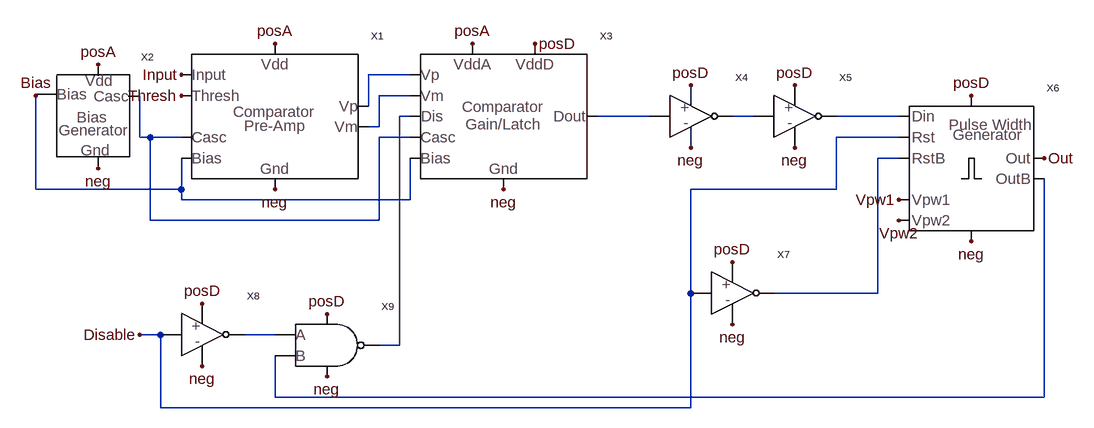
[diagram p0: schematic comparatorLVS.asc]
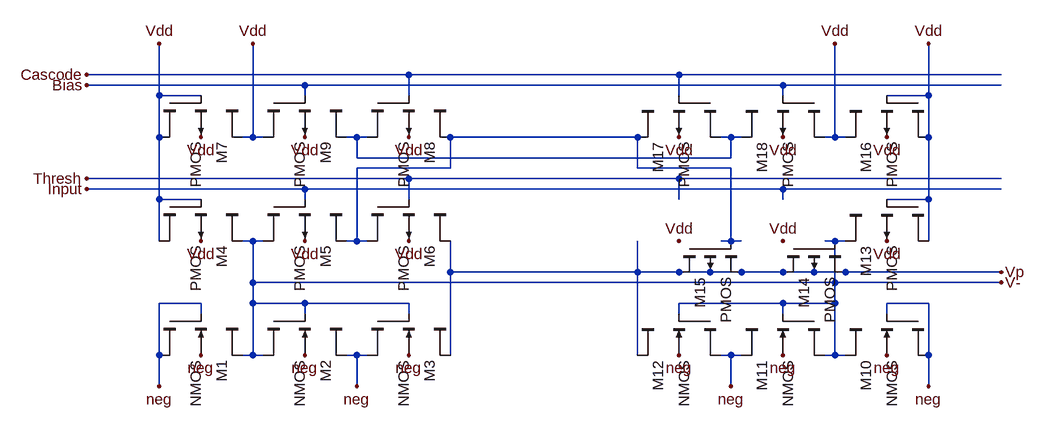
[diagram p1: sub-circuit doublecomparatorpreamplvs.asc]
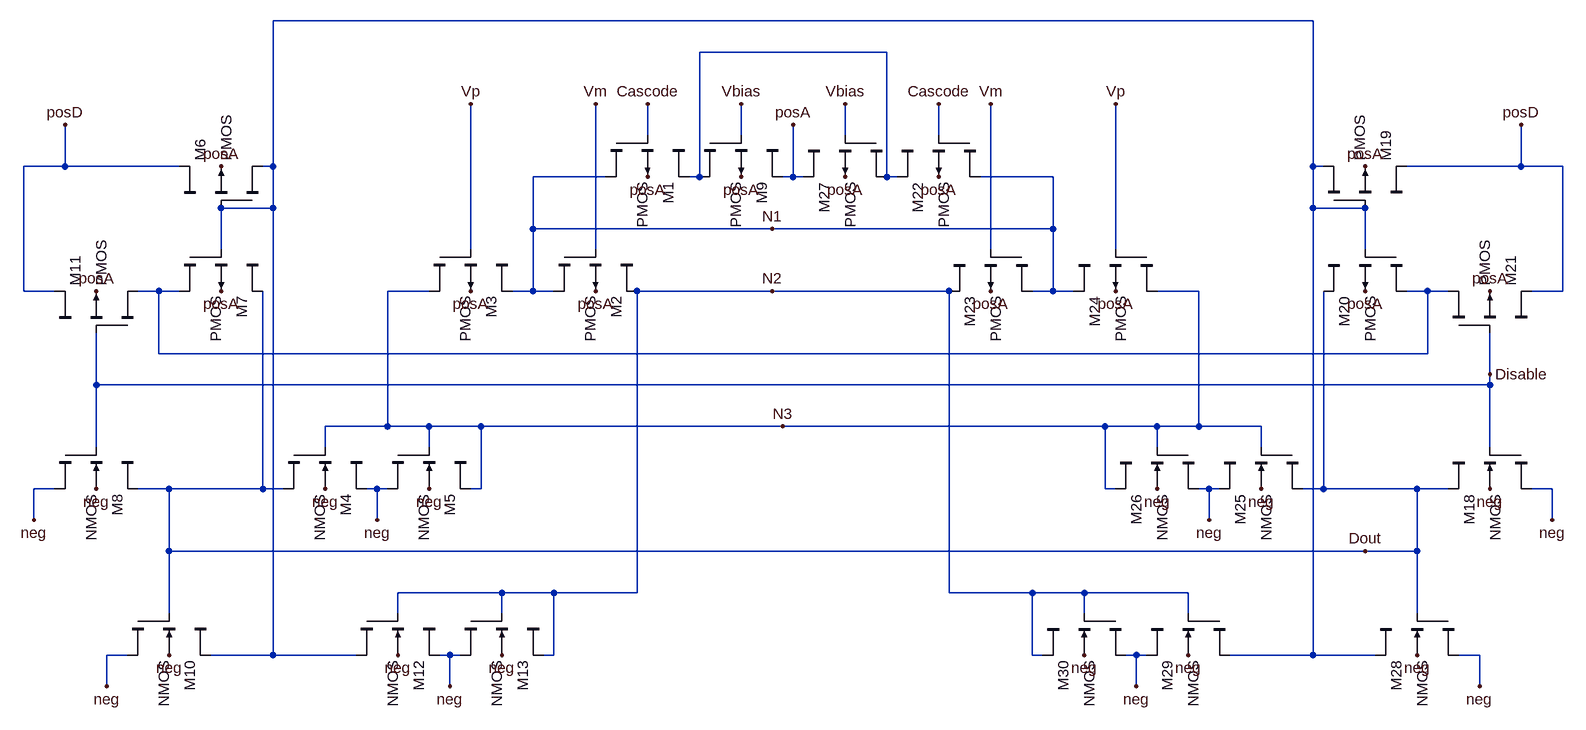
[diagram p2: sub-circuit comparator_gainlatch_lds.asc]
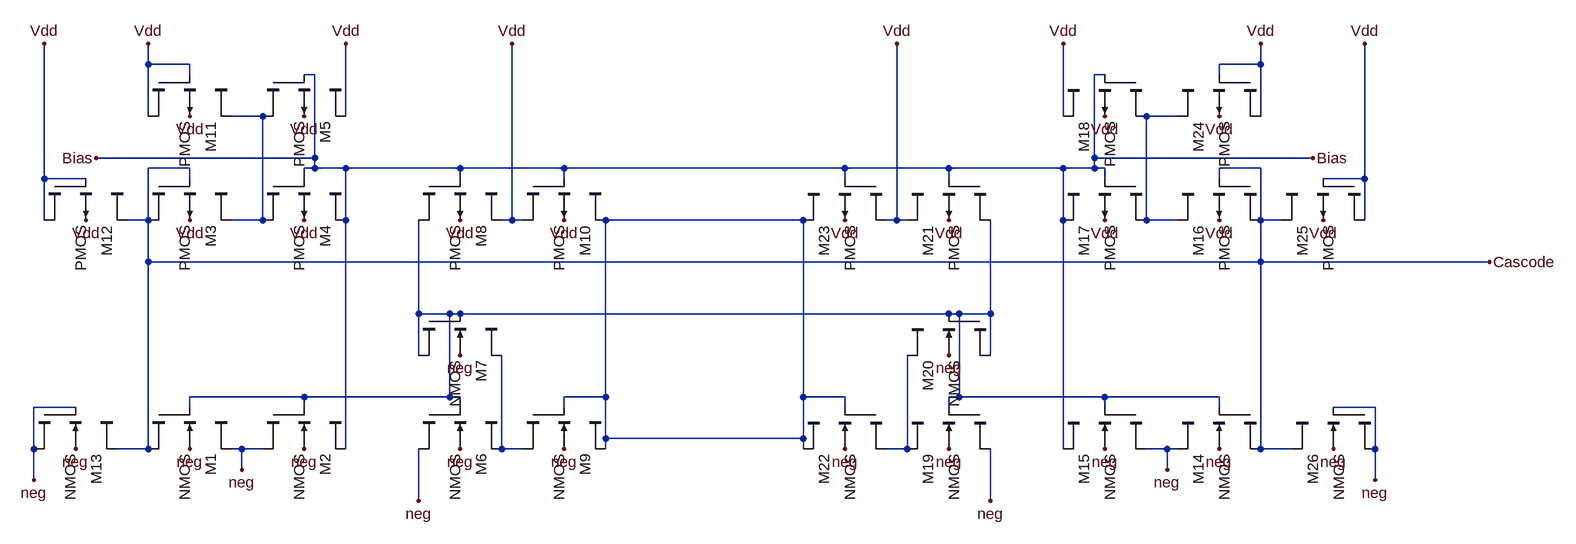
[diagram p3: sub-circuit doublebiaslvs.asc]
comparatorLVS.asc, the LTspice schematic file:
Version 4
SHEET 1 1360 680
WIRE 320 112 256 112
WIRE 320 144 272 144
WIRE 256 160 256 112
WIRE 320 176 304 176
WIRE 688 176 608 176
WIRE 848 176 816 176
WIRE 1072 176 976 176
WIRE 272 192 272 144
WIRE 272 192 256 192
WIRE -96 208 -96 144
WIRE -80 208 -96 208
WIRE -32 208 -80 208
WIRE 320 208 272 208
WIRE 1072 208 976 208
WIRE 1072 240 1040 240
WIRE -256 288 -256 144
WIRE -32 288 -32 240
WIRE -32 288 -256 288
WIRE 976 288 976 208
WIRE 976 288 752 288
WIRE -32 304 -32 288
WIRE 320 304 320 240
WIRE 320 304 -32 304
WIRE -80 336 -80 208
WIRE 272 336 272 208
WIRE 272 336 -80 336
WIRE 752 448 752 288
WIRE 1040 448 1040 240
WIRE 1040 448 880 448
WIRE -64 512 -96 512
WIRE 112 512 64 512
WIRE 304 528 304 176
WIRE 304 528 272 528
WIRE 112 608 112 544
WIRE 1296 608 1296 272
WIRE 1296 608 112 608
WIRE -64 624 -64 512
WIRE 752 624 752 448
WIRE 752 624 -64 624
FLAG -32 112 Input
FLAG -32 144 Thresh
FLAG -256 144 Bias
FLAG -160 96 posA
FLAG 112 64 posA
FLAG 416 64 posA
FLAG 512 64 posD
FLAG 752 128 posD
FLAG -160 256 neg
FLAG 112 288 neg
FLAG 464 288 neg
FLAG 752 224 neg
FLAG 912 128 posD
FLAG 912 224 neg
FLAG 1184 144 posD
FLAG 1184 368 neg
FLAG 816 400 posD
FLAG 816 496 neg
FLAG 0 560 neg
FLAG -96 512 Disable
FLAG 0 464 posD
FLAG 192 480 posD
FLAG 192 576 neg
FLAG 1296 240 Out
FLAG 1072 304 Vpw1
FLAG 1072 336 Vpw2
SYMBOL doubleComparatorPreampLVS 112 176 R0
SYMATTR InstName X1
SYMBOL comparator_gainlatch_LDS 464 176 R0
SYMATTR InstName X3
SYMBOL doublebiasLVS -176 176 R0
SYMATTR InstName X2
SYMBOL Inverter 752 176 R0
SYMATTR InstName X4
SYMBOL Inverter 912 176 R0
SYMATTR InstName X5
SYMBOL PulseWidthControl_LDS 1184 256 R0
SYMATTR InstName X6
SYMBOL Inverter 816 448 R0
SYMATTR InstName X7
SYMBOL Inverter 0 512 R0
SYMATTR InstName X8
SYMBOL nandLVS 192 528 R0
SYMATTR InstName X9

doublecomparatorpreamplvs.asc, the sub-circuit schematic file:
Version 4
SHEET 1 1456 680
WIRE 416 -192 -80 -192
WIRE 832 -192 416 -192
WIRE 1328 -192 832 -192
WIRE 256 -176 -80 -176
WIRE 992 -176 256 -176
WIRE 1328 -176 992 -176
WIRE 32 -160 32 -240
WIRE 96 -160 32 -160
WIRE 256 -160 256 -176
WIRE 416 -160 416 -192
WIRE 832 -160 832 -192
WIRE 992 -160 992 -176
WIRE 1216 -160 1216 -240
WIRE 1216 -160 1152 -160
WIRE 32 -96 32 -160
WIRE 176 -96 176 -240
WIRE 176 -96 160 -96
WIRE 192 -96 176 -96
WIRE 336 -96 320 -96
WIRE 352 -96 336 -96
WIRE 768 -96 480 -96
WIRE 912 -96 896 -96
WIRE 928 -96 912 -96
WIRE 1072 -96 1072 -240
WIRE 1072 -96 1056 -96
WIRE 1088 -96 1072 -96
WIRE 1216 -96 1216 -160
WIRE 336 -64 336 -96
WIRE 912 -64 912 -96
WIRE 912 -64 336 -64
WIRE 480 -48 480 -96
WIRE 480 -48 336 -48
WIRE 768 -48 768 -96
WIRE 912 -48 768 -48
WIRE 416 -32 -80 -32
WIRE 832 -32 416 -32
WIRE 1328 -32 832 -32
WIRE 256 -16 -80 -16
WIRE 992 -16 256 -16
WIRE 1328 -16 992 -16
WIRE 32 0 32 -96
WIRE 96 0 32 0
WIRE 256 0 256 -16
WIRE 416 0 416 -32
WIRE 832 0 832 -32
WIRE 992 0 992 -16
WIRE 1216 0 1216 -96
WIRE 1216 0 1152 0
WIRE 32 64 32 0
WIRE 176 64 160 64
WIRE 192 64 176 64
WIRE 336 64 336 -48
WIRE 336 64 320 64
WIRE 352 64 336 64
WIRE 912 64 912 -48
WIRE 912 64 896 64
WIRE 928 64 912 64
WIRE 1072 64 1056 64
WIRE 1088 64 1072 64
WIRE 1216 64 1216 0
WIRE 480 112 480 64
WIRE 768 112 768 64
WIRE 768 112 480 112
WIRE 1328 112 768 112
WIRE 176 128 176 64
WIRE 1072 128 1072 64
WIRE 1072 128 176 128
WIRE 1328 128 1072 128
WIRE 96 160 32 160
WIRE 176 160 176 128
WIRE 256 160 176 160
WIRE 416 160 256 160
WIRE 992 160 832 160
WIRE 1072 160 1072 128
WIRE 1072 160 992 160
WIRE 1216 160 1152 160
WIRE 96 176 96 160
WIRE 256 176 256 160
WIRE 416 176 416 160
WIRE 832 176 832 160
WIRE 992 176 992 160
WIRE 1152 176 1152 160
WIRE 32 240 32 160
WIRE 176 240 176 160
WIRE 176 240 160 240
WIRE 192 240 176 240
WIRE 336 240 320 240
WIRE 352 240 336 240
WIRE 480 240 480 112
WIRE 768 240 768 112
WIRE 912 240 896 240
WIRE 928 240 912 240
WIRE 1072 240 1072 160
WIRE 1072 240 1056 240
WIRE 1088 240 1072 240
WIRE 1216 240 1216 160
WIRE 32 288 32 240
WIRE 336 288 336 240
WIRE 912 288 912 240
WIRE 1216 288 1216 240
FLAG 96 64 Vdd
FLAG 256 64 Vdd
FLAG 416 64 Vdd
FLAG 96 -96 Vdd
FLAG 416 -96 Vdd
FLAG 256 -96 Vdd
FLAG 32 -240 Vdd
FLAG 176 -240 Vdd
FLAG -80 -16 Input
FLAG -80 -32 Thresh
FLAG -80 -192 Cascode
FLAG -80 -176 Bias
FLAG 1152 64 Vdd
FLAG 992 64 Vdd
FLAG 832 64 Vdd
FLAG 1152 -96 Vdd
FLAG 832 -96 Vdd
FLAG 992 -96 Vdd
FLAG 1216 -240 Vdd
FLAG 1072 -240 Vdd
FLAG 1328 112 Vp
FLAG 1216 288 neg
FLAG 1152 240 neg
FLAG 992 240 neg
FLAG 912 288 neg
FLAG 416 240 neg
FLAG 336 288 neg
FLAG 256 240 neg
FLAG 96 240 neg
FLAG 32 288 neg
FLAG 832 240 neg
FLAG 1328 128 V-
SYMBOL cktsym\\nmos4 96 240 R90
SYMATTR InstName M1
SYMATTR Value2 l=.9u w=1.5u
SYMBOL cktsym\\nmos4 256 240 R90
SYMATTR InstName M2
SYMATTR Value2 l=.9u w=1.5u
SYMBOL cktsym\\nmos4 416 240 R90
SYMATTR InstName M3
SYMATTR Value2 l=.9u w=1.5u
SYMBOL cktsym\\pmos4 96 64 R90
SYMATTR InstName M4
SYMATTR Value2 l=.9u w=1.5u
SYMBOL cktsym\\pmos4 256 64 R90
SYMATTR InstName M5
SYMATTR Value2 l=.9u w=1.5u
SYMBOL cktsym\\pmos4 416 64 R90
SYMATTR InstName M6
SYMATTR Value2 l=.9u w=1.5u
SYMBOL cktsym\\pmos4 96 -96 R90
SYMATTR InstName M7
SYMATTR Value2 l=.9u w=1.8u
SYMBOL cktsym\\pmos4 416 -96 R90
SYMATTR InstName M8
SYMATTR Value2 l=.9u w=1.8u
SYMBOL cktsym\\pmos4 256 -96 R90
SYMATTR InstName M9
SYMATTR Value2 l=3.9u w=8.1u
SYMBOL cktsym\\nmos4 1152 240 M90
SYMATTR InstName M10
SYMATTR Value2 l=.9u w=1.5u
SYMBOL cktsym\\nmos4 992 240 M90
SYMATTR InstName M11
SYMATTR Value2 l=.9u w=1.5u
SYMBOL cktsym\\nmos4 832 240 M90
SYMATTR InstName M12
SYMATTR Value2 l=.9u w=1.5u
SYMBOL cktsym\\pmos4 1152 64 M90
SYMATTR InstName M13
SYMATTR Value2 l=.9u w=1.5u
SYMBOL cktsym\\pmos4 992 64 M90
SYMATTR InstName M14
SYMATTR Value2 l=.9u w=1.5u
SYMBOL cktsym\\pmos4 832 64 M90
SYMATTR InstName M15
SYMATTR Value2 l=.9u w=1.5u
SYMBOL cktsym\\pmos4 1152 -96 M90
SYMATTR InstName M16
SYMATTR Value2 l=.9u w=1.8u
SYMBOL cktsym\\pmos4 832 -96 M90
SYMATTR InstName M17
SYMATTR Value2 l=.9u w=1.8u
SYMBOL cktsym\\pmos4 992 -96 M90
SYMATTR InstName M18
SYMATTR Value2 l=3.9u w=8.1u

comparator_gainlatch_lds.asc, the sub-circuit schematic file:
Version 4
SHEET 1 2168 1948
WIRE 1536 80 -64 80
WIRE 880 128 592 128
WIRE 512 256 512 208
WIRE 656 256 656 208
WIRE 816 256 816 208
WIRE 960 256 960 208
WIRE -384 304 -384 240
WIRE -384 304 -448 304
WIRE -208 304 -384 304
WIRE -64 304 -64 80
WIRE -64 304 -80 304
WIRE 1536 304 1536 80
WIRE 1552 304 1536 304
WIRE 1856 304 1856 240
WIRE 1856 304 1680 304
WIRE 1920 304 1856 304
WIRE 448 320 336 320
WIRE 592 320 592 128
WIRE 592 320 576 320
WIRE 736 320 736 240
WIRE 736 320 720 320
WIRE 752 320 736 320
WIRE 880 320 880 128
WIRE 896 320 880 320
WIRE 1136 320 1024 320
WIRE -64 368 -64 304
WIRE -64 368 -144 368
WIRE 1536 368 1536 304
WIRE 1616 368 1536 368
WIRE 336 400 336 320
WIRE 704 400 336 400
WIRE 1136 400 1136 320
WIRE 1136 400 704 400
WIRE -144 432 -144 368
WIRE 240 432 240 208
WIRE 432 432 432 208
WIRE 1040 432 1040 208
WIRE 1232 432 1232 208
WIRE 1616 432 1616 368
WIRE -448 496 -448 304
WIRE -400 496 -448 496
WIRE -240 496 -272 496
WIRE -208 496 -240 496
WIRE 176 496 112 496
WIRE 336 496 336 400
WIRE 336 496 304 496
WIRE 368 496 336 496
WIRE 704 496 496 496
WIRE 976 496 704 496
WIRE 1136 496 1136 400
WIRE 1136 496 1104 496
WIRE 1168 496 1136 496
WIRE 1360 496 1296 496
WIRE 1712 496 1680 496
WIRE 1744 496 1712 496
WIRE 1920 496 1920 304
WIRE 1920 496 1872 496
WIRE -240 592 -240 496
WIRE 1712 592 1712 496
WIRE 1712 592 -240 592
WIRE 1808 624 1808 560
WIRE -336 640 -336 560
WIRE 1808 640 1808 624
WIRE 1808 640 -336 640
WIRE 112 704 112 496
WIRE 112 704 16 704
WIRE 176 704 112 704
WIRE 256 704 176 704
WIRE 720 704 256 704
WIRE 1216 704 720 704
WIRE 1296 704 1216 704
WIRE 1360 704 1360 496
WIRE 1360 704 1296 704
WIRE 1456 704 1360 704
WIRE -336 736 -336 640
WIRE 16 736 16 704
WIRE 176 736 176 704
WIRE 1296 736 1296 704
WIRE 1456 736 1456 704
WIRE 1808 736 1808 640
WIRE -400 800 -432 800
WIRE -224 800 -272 800
WIRE -80 800 -80 496
WIRE -80 800 -224 800
WIRE -48 800 -80 800
WIRE 96 800 80 800
WIRE 112 800 96 800
WIRE 256 800 256 704
WIRE 256 800 240 800
WIRE 1216 800 1216 704
WIRE 1232 800 1216 800
WIRE 1376 800 1360 800
WIRE 1392 800 1376 800
WIRE 1552 800 1552 496
WIRE 1552 800 1520 800
WIRE 1696 800 1552 800
WIRE 1744 800 1696 800
WIRE 1904 800 1872 800
WIRE -432 848 -432 800
WIRE 96 848 96 800
WIRE 1376 848 1376 800
WIRE 1904 848 1904 800
WIRE -224 896 -224 800
WIRE 1616 896 -224 896
WIRE 1696 896 1696 800
WIRE 1696 896 1616 896
WIRE 288 960 128 960
WIRE 368 960 288 960
WIRE 496 960 496 496
WIRE 496 960 368 960
WIRE 976 960 976 496
WIRE 1104 960 976 960
WIRE 1184 960 1104 960
WIRE 1344 960 1184 960
WIRE -224 992 -224 896
WIRE 128 992 128 960
WIRE 288 992 288 960
WIRE 1184 992 1184 960
WIRE 1344 992 1344 960
WIRE 1696 992 1696 896
WIRE -288 1056 -320 1056
WIRE -64 1056 -64 368
WIRE -64 1056 -160 1056
WIRE 64 1056 -64 1056
WIRE 208 1056 192 1056
WIRE 224 1056 208 1056
WIRE 368 1056 368 960
WIRE 368 1056 352 1056
WIRE 1104 1056 1104 960
WIRE 1120 1056 1104 1056
WIRE 1264 1056 1248 1056
WIRE 1280 1056 1264 1056
WIRE 1536 1056 1536 368
WIRE 1536 1056 1408 1056
WIRE 1632 1056 1536 1056
WIRE 1792 1056 1760 1056
WIRE -320 1104 -320 1056
WIRE 208 1104 208 1056
WIRE 1264 1104 1264 1056
WIRE 1792 1104 1792 1056
FLAG -336 800 neg
FLAG -144 304 posA
FLAG -384 240 posD
FLAG 512 320 posA
FLAG -336 496 posA
FLAG -144 496 posA
FLAG 16 800 neg
FLAG 176 800 neg
FLAG 240 496 posA
FLAG 432 496 posA
FLAG 656 320 posA
FLAG 512 208 Cascode
FLAG 656 208 Vbias
FLAG 240 208 Vp
FLAG 432 208 Vm
FLAG -224 1056 neg
FLAG 128 1056 neg
FLAG 288 1056 neg
FLAG -320 1104 neg
FLAG 208 1104 neg
FLAG 96 848 neg
FLAG -432 848 neg
FLAG 1808 800 neg
FLAG 1616 304 posA
FLAG 1856 240 posD
FLAG 960 320 posA
FLAG 1808 496 posA
FLAG 1616 496 posA
FLAG 1456 800 neg
FLAG 1296 800 neg
FLAG 1232 496 posA
FLAG 1040 496 posA
FLAG 816 320 posA
FLAG 736 240 posA
FLAG 960 208 Cascode
FLAG 816 208 Vbias
FLAG 1232 208 Vp
FLAG 1040 208 Vm
FLAG 1696 1056 neg
FLAG 1344 1056 neg
FLAG 1184 1056 neg
FLAG 1792 1104 neg
FLAG 1264 1104 neg
FLAG 1376 848 neg
FLAG 1904 848 neg
FLAG 704 400 N1
FLAG 704 496 N2
FLAG 720 704 N3
FLAG 1808 624 Disable
FLAG 1616 896 Dout
SYMBOL cktsym\\nmos4 -336 800 R90
SYMATTR InstName M8
SYMATTR Value2 l=1.8u w=3.6u
SYMBOL cktsym\\pmos4 -144 304 R270
SYMATTR InstName M6
SYMATTR Value2 l=2.7u w=4.5u
SYMBOL cktsym\\pmos4 -144 496 R90
SYMATTR InstName M7
SYMATTR Value2 l=0.6u w=0.9u
SYMBOL cktsym\\pmos4 -336 496 R270
SYMATTR InstName M11
SYMATTR Value2 l=2.7u w=4.5u
SYMBOL cktsym\\pmos4 512 320 R90
SYMATTR InstName M1
SYMATTR Value2 l=2.4u w=4.8u
SYMBOL cktsym\\pmos4 432 496 R90
SYMATTR InstName M2
SYMATTR Value2 l=3.6u w=3.6u
SYMBOL cktsym\\pmos4 240 496 R90
SYMATTR InstName M3
SYMATTR Value2 l=3.6u w=3.6u
SYMBOL cktsym\\nmos4 16 800 R90
SYMATTR InstName M4
SYMATTR Value2 l=2.7u w=2.4u
SYMBOL cktsym\\nmos4 176 800 R90
SYMATTR InstName M5
SYMATTR Value2 l=2.7u w=2.4u
SYMBOL cktsym\\pmos4 656 320 R90
SYMATTR InstName M9
SYMATTR Value2 l=18u w=9u
SYMBOL cktsym\\nmos4 -224 1056 R90
SYMATTR InstName M10
SYMATTR Value2 l=1.8u w=3.6u
SYMBOL cktsym\\nmos4 128 1056 R90
SYMATTR InstName M12
SYMATTR Value2 l=2.7u w=2.4u
SYMBOL cktsym\\nmos4 288 1056 R90
SYMATTR InstName M13
SYMATTR Value2 l=2.7u w=2.4u
SYMBOL cktsym\\nmos4 1808 800 M90
SYMATTR InstName M18
SYMATTR Value2 l=1.8u w=3.6u
SYMBOL cktsym\\pmos4 1616 304 M270
SYMATTR InstName M19
SYMATTR Value2 l=2.7u w=4.5u
SYMBOL cktsym\\pmos4 1616 496 M90
SYMATTR InstName M20
SYMATTR Value2 l=0.6u w=0.9u
SYMBOL cktsym\\pmos4 1808 496 M270
SYMATTR InstName M21
SYMATTR Value2 l=2.7u w=4.5u
SYMBOL cktsym\\pmos4 960 320 M90
SYMATTR InstName M22
SYMATTR Value2 l=2.4u w=4.8u
SYMBOL cktsym\\pmos4 1040 496 M90
SYMATTR InstName M23
SYMATTR Value2 l=3.6u w=3.6u
SYMBOL cktsym\\pmos4 1232 496 M90
SYMATTR InstName M24
SYMATTR Value2 l=3.6u w=3.6u
SYMBOL cktsym\\nmos4 1456 800 M90
SYMATTR InstName M25
SYMATTR Value2 l=2.7u w=2.4u
SYMBOL cktsym\\nmos4 1296 800 M90
SYMATTR InstName M26
SYMATTR Value2 l=2.7u w=2.4u
SYMBOL cktsym\\pmos4 816 320 M90
SYMATTR InstName M27
SYMATTR Value2 l=18u w=9u
SYMBOL cktsym\\nmos4 1696 1056 M90
SYMATTR InstName M28
SYMATTR Value2 l=1.8u w=3.6u
SYMBOL cktsym\\nmos4 1344 1056 M90
SYMATTR InstName M29
SYMATTR Value2 l=2.7u w=2.4u
SYMBOL cktsym\\nmos4 1184 1056 M90
SYMATTR InstName M30
SYMATTR Value2 l=2.7u w=2.4u

doublebiaslvs.asc, the sub-circuit schematic file:
Version 4
SHEET 1 2224 680
WIRE 32 -272 32 -304
WIRE 96 -272 32 -272
WIRE 1744 -272 1744 -304
WIRE 1744 -272 1680 -272
WIRE 96 -256 96 -272
WIRE 288 -256 272 -256
WIRE 1504 -256 1488 -256
WIRE 1680 -256 1680 -272
WIRE 32 -192 32 -272
WIRE 208 -192 160 -192
WIRE 336 -192 336 -304
WIRE 1440 -192 1440 -304
WIRE 1616 -192 1568 -192
WIRE 1744 -192 1744 -272
WIRE 288 -128 288 -256
WIRE 288 -128 -48 -128
WIRE 1488 -128 1488 -256
WIRE 1824 -128 1488 -128
WIRE 96 -112 32 -112
WIRE 288 -112 288 -128
WIRE 288 -112 272 -112
WIRE 336 -112 288 -112
WIRE 512 -112 336 -112
WIRE 672 -112 512 -112
WIRE 1104 -112 672 -112
WIRE 1264 -112 1104 -112
WIRE 1440 -112 1264 -112
WIRE 1488 -112 1488 -128
WIRE 1488 -112 1440 -112
WIRE 1504 -112 1488 -112
WIRE 1744 -112 1680 -112
WIRE -128 -96 -128 -304
WIRE -64 -96 -128 -96
WIRE 96 -96 96 -112
WIRE 272 -96 272 -112
WIRE 512 -96 512 -112
WIRE 672 -96 672 -112
WIRE 1104 -96 1104 -112
WIRE 1264 -96 1264 -112
WIRE 1504 -96 1504 -112
WIRE 1680 -96 1680 -112
WIRE 1904 -96 1904 -304
WIRE 1904 -96 1840 -96
WIRE -128 -32 -128 -96
WIRE 32 -32 32 -112
WIRE 32 -32 0 -32
WIRE 208 -32 208 -192
WIRE 208 -32 160 -32
WIRE 336 -32 336 -112
WIRE 592 -32 592 -304
WIRE 592 -32 576 -32
WIRE 608 -32 592 -32
WIRE 1040 -32 736 -32
WIRE 1184 -32 1184 -304
WIRE 1184 -32 1168 -32
WIRE 1200 -32 1184 -32
WIRE 1440 -32 1440 -112
WIRE 1568 -32 1568 -192
WIRE 1616 -32 1568 -32
WIRE 1744 -32 1744 -112
WIRE 1776 -32 1744 -32
WIRE 1904 -32 1904 -96
WIRE 32 32 32 -32
WIRE 1744 32 1744 -32
WIRE 1744 32 32 32
WIRE 2096 32 1744 32
WIRE 448 112 448 -32
WIRE 496 112 448 112
WIRE 512 112 496 112
WIRE 1264 112 512 112
WIRE 1280 112 1264 112
WIRE 1328 112 1328 -32
WIRE 1328 112 1280 112
WIRE 448 176 448 112
WIRE 1328 176 1328 112
WIRE 272 240 96 240
WIRE 496 240 496 112
WIRE 496 240 272 240
WIRE 512 240 496 240
WIRE 736 240 736 -32
WIRE 736 240 672 240
WIRE 1040 240 1040 -32
WIRE 1104 240 1040 240
WIRE 1280 240 1280 112
WIRE 1280 240 1264 240
WIRE 1504 240 1280 240
WIRE 1680 240 1504 240
WIRE -80 256 -144 256
WIRE 96 256 96 240
WIRE 272 256 272 240
WIRE 512 256 512 240
WIRE 672 256 672 240
WIRE 1104 256 1104 240
WIRE 1264 256 1264 240
WIRE 1504 256 1504 240
WIRE 1680 256 1680 240
WIRE 1920 256 1856 256
WIRE 736 304 736 240
WIRE 1040 304 1040 240
WIRE 1040 304 736 304
WIRE -144 320 -144 256
WIRE 32 320 32 32
WIRE 32 320 -16 320
WIRE 176 320 160 320
WIRE 208 320 176 320
WIRE 336 320 336 -32
WIRE 576 320 576 176
WIRE 608 320 576 320
WIRE 736 320 736 304
WIRE 1040 320 1040 304
WIRE 1200 320 1200 176
WIRE 1200 320 1168 320
WIRE 1440 320 1440 -32
WIRE 1600 320 1568 320
WIRE 1616 320 1600 320
WIRE 1744 320 1744 32
WIRE 1792 320 1744 320
WIRE 1920 320 1920 256
WIRE 176 352 176 320
WIRE 1600 352 1600 320
WIRE -144 368 -144 320
WIRE 1920 368 1920 320
WIRE 448 400 448 320
WIRE 1328 400 1328 320
FLAG 96 -32 Vdd
FLAG 272 -32 Vdd
FLAG 272 -192 Vdd
FLAG 336 -304 Vdd
FLAG 512 -32 Vdd
FLAG 672 -32 Vdd
FLAG 592 -304 Vdd
FLAG -48 -128 Bias
FLAG 96 -192 Vdd
FLAG 32 -304 Vdd
FLAG -128 -304 Vdd
FLAG -64 -32 Vdd
FLAG 1680 -32 Vdd
FLAG 1504 -32 Vdd
FLAG 1504 -192 Vdd
FLAG 1440 -304 Vdd
FLAG 1264 -32 Vdd
FLAG 1104 -32 Vdd
FLAG 1184 -304 Vdd
FLAG 1824 -128 Bias
FLAG 1680 -192 Vdd
FLAG 1744 -304 Vdd
FLAG 1904 -304 Vdd
FLAG 1840 -32 Vdd
FLAG 2096 32 Cascode
FLAG 1920 368 neg
FLAG 1856 320 neg
FLAG 1680 320 neg
FLAG 1600 352 neg
FLAG 1504 320 neg
FLAG 1328 400 neg
FLAG 1264 320 neg
FLAG 1104 320 neg
FLAG 672 320 neg
FLAG 512 320 neg
FLAG 448 400 neg
FLAG 272 320 neg
FLAG 176 352 neg
FLAG 96 320 neg
FLAG -80 320 neg
FLAG -144 368 neg
FLAG 512 176 neg
FLAG 1264 176 neg
SYMBOL cktsym\\nmos4 96 320 R90
SYMATTR InstName M1
SYMATTR Value2 l=3.9u w=2.1u
SYMBOL cktsym\\nmos4 272 320 R90
SYMATTR InstName M2
SYMATTR Value2 l=8.1u w=.9u
SYMBOL cktsym\\pmos4 96 -32 R90
SYMATTR InstName M3
SYMATTR Value2 l=3.9u w=8.1u
SYMBOL cktsym\\pmos4 272 -32 R90
SYMATTR InstName M4
SYMATTR Value2 l=.9u w=8.1u
SYMBOL cktsym\\pmos4 272 -192 R90
SYMATTR InstName M5
SYMATTR Value2 l=3.9u w=8.1u
SYMBOL cktsym\\nmos4 512 320 R90
SYMATTR InstName M6
SYMATTR Value2 l=3.9u w=2.1u
SYMBOL cktsym\\nmos4 512 176 R90
SYMATTR InstName M7
SYMATTR Value2 l=3.9u w=8.1u
SYMBOL cktsym\\pmos4 512 -32 R90
SYMATTR InstName M8
SYMATTR Value2 l=3.9u w=1.8u
SYMBOL cktsym\\nmos4 672 320 R90
SYMATTR InstName M9
SYMATTR Value2 l=3.9u w=2.1u
SYMBOL cktsym\\pmos4 672 -32 R90
SYMATTR InstName M10
SYMATTR Value2 l=3.9u w=8.1u
SYMBOL cktsym\\pmos4 96 -192 R90
SYMATTR InstName M11
SYMATTR Value2 l=3.9u w=8.1u
SYMBOL cktsym\\pmos4 -64 -32 R90
SYMATTR InstName M12
SYMATTR Value2 l=3.9u w=8.1u
SYMBOL cktsym\\nmos4 -80 320 R90
SYMATTR InstName M13
SYMATTR Value2 l=3.9u w=2.1u
SYMBOL cktsym\\nmos4 1680 320 M90
SYMATTR InstName M14
SYMATTR Value2 l=3.9u w=2.1u
SYMBOL cktsym\\nmos4 1504 320 M90
SYMATTR InstName M15
SYMATTR Value2 l=8.1u w=.9u
SYMBOL cktsym\\pmos4 1680 -32 M90
SYMATTR InstName M16
SYMATTR Value2 l=3.9u w=8.1u
SYMBOL cktsym\\pmos4 1504 -32 M90
SYMATTR InstName M17
SYMATTR Value2 l=.9u w=8.1u
SYMBOL cktsym\\pmos4 1504 -192 M90
SYMATTR InstName M18
SYMATTR Value2 l=3.9u w=8.1u
SYMBOL cktsym\\nmos4 1264 320 M90
SYMATTR InstName M19
SYMATTR Value2 l=3.9u w=2.1u
SYMBOL cktsym\\nmos4 1264 176 M90
SYMATTR InstName M20
SYMATTR Value2 l=3.9u w=8.1u
SYMBOL cktsym\\pmos4 1264 -32 M90
SYMATTR InstName M21
SYMATTR Value2 l=3.9u w=1.8u
SYMBOL cktsym\\nmos4 1104 320 M90
SYMATTR InstName M22
SYMATTR Value2 l=3.9u w=2.1u
SYMBOL cktsym\\pmos4 1104 -32 M90
SYMATTR InstName M23
SYMATTR Value2 l=3.9u w=8.1u
SYMBOL cktsym\\pmos4 1680 -192 M90
SYMATTR InstName M24
SYMATTR Value2 l=3.9u w=8.1u
SYMBOL cktsym\\pmos4 1840 -32 M90
SYMATTR InstName M25
SYMATTR Value2 l=3.9u w=8.1u
SYMBOL cktsym\\nmos4 1856 320 M90
SYMATTR InstName M26
SYMATTR Value2 l=3.9u w=2.1u

The netlist it stands for:
* comparatorLVS.asc
XX1 Input Thresh N007 Bias posA neg N001 N002 doublecomparatorpreamplvs
XX3 N001 N002 N003 N007 Bias posA posD neg N004 comparator_gainlatch_lds
XX2 posA neg Bias N007 doublebiaslvs
XX4 N004 N005 posD neg Inverter  ; pins IN OUT pos neg
XX5 N005 N006 posD neg Inverter  ; pins IN OUT pos neg
XX6 N006 Disable N008 Vpw1 Vpw2 posD neg Out N010 PulseWidthControl_LDS  ; pins Din Reset ResetB Vpw1 Vpw2 pos neg Out OutB
XX7 Disable N008 posD neg Inverter  ; pins IN OUT pos neg
XX8 Disable N009 posD neg Inverter  ; pins IN OUT pos neg
XX9 N009 N003 N010 posD neg nandLVS  ; pins A OUT B pos neg

* block symbol definitions
.subckt doublecomparatorpreamplvs Input Thresh Cascode Bias Vdd neg Vp V-
M1 V- neg neg neg NMOS l=.9u w=1.5u
M2 neg V- V- neg NMOS l=.9u w=1.5u
M3 Vp V- neg neg NMOS l=.9u w=1.5u
M4 Vdd Vdd V- Vdd PMOS l=.9u w=1.5u
M5 V- Input N002 Vdd PMOS l=.9u w=1.5u
M6 N002 Thresh Vp Vdd PMOS l=.9u w=1.5u
M7 Vdd Vdd Vdd Vdd PMOS l=.9u w=1.8u
M8 N001 Cascode N002 Vdd PMOS l=.9u w=1.8u
M9 Vdd Bias N001 Vdd PMOS l=3.9u w=8.1u
M10 V- neg neg neg NMOS l=.9u w=1.5u
M11 neg V- V- neg NMOS l=.9u w=1.5u
M12 Vp V- neg neg NMOS l=.9u w=1.5u
M13 Vdd Vdd V- Vdd PMOS l=.9u w=1.5u
M14 Vp V- Vp Vp PMOS l=.9u w=1.5u
M15 Vp N002 Vp Vp PMOS l=.9u w=1.5u
M16 Vdd Vdd Vdd Vdd PMOS l=.9u w=1.8u
M17 N001 Cascode N002 Vdd PMOS l=.9u w=1.8u
M18 Vdd Bias N001 Vdd PMOS l=3.9u w=8.1u
.ends doublecomparatorpreamplvs

.subckt comparator_gainlatch_lds Vp Vm Disable Cascode Vbias posA posD neg Dout
M8 Dout Disable neg neg NMOS l=1.8u w=3.6u
M6 N001 N001 posD posA PMOS l=2.7u w=4.5u
M7 N003 N001 Dout posA PMOS l=0.6u w=0.9u
M11 N003 Disable posD posA PMOS l=2.7u w=4.5u
M1 N1 Cascode N002 posA PMOS l=2.4u w=4.8u
M2 N1 Vm N2 posA PMOS l=3.6u w=3.6u
M3 N3 Vp N1 posA PMOS l=3.6u w=3.6u
M4 neg N3 Dout neg NMOS l=2.7u w=2.4u
M5 N3 N3 neg neg NMOS l=2.7u w=2.4u
M9 N002 Vbias posA posA PMOS l=18u w=9u
M10 N001 Dout neg neg NMOS l=1.8u w=3.6u
M12 neg N2 N001 neg NMOS l=2.7u w=2.4u
M13 N2 N2 neg neg NMOS l=2.7u w=2.4u
M18 Dout Disable neg neg NMOS l=1.8u w=3.6u
M19 N001 N001 posD posA PMOS l=2.7u w=4.5u
M20 N003 N001 Dout posA PMOS l=0.6u w=0.9u
M21 N003 Disable posD posA PMOS l=2.7u w=4.5u
M22 N1 Cascode N002 posA PMOS l=2.4u w=4.8u
M23 N1 Vm N2 posA PMOS l=3.6u w=3.6u
M24 N3 Vp N1 posA PMOS l=3.6u w=3.6u
M25 neg N3 Dout neg NMOS l=2.7u w=2.4u
M26 N3 N3 neg neg NMOS l=2.7u w=2.4u
M27 N002 Vbias posA posA PMOS l=18u w=9u
M28 N001 Dout neg neg NMOS l=1.8u w=3.6u
M29 neg N2 N001 neg NMOS l=2.7u w=2.4u
M30 N2 N2 neg neg NMOS l=2.7u w=2.4u
.ends comparator_gainlatch_lds

.subckt doublebiaslvs Vdd neg Bias Cascode
M1 neg N004 Cascode neg NMOS l=3.9u w=2.1u
M2 Bias N004 neg neg NMOS l=8.1u w=.9u
M3 Cascode Cascode N001 Vdd PMOS l=3.9u w=8.1u
M4 N001 Bias Bias Vdd PMOS l=.9u w=8.1u
M5 N001 Bias Vdd Vdd PMOS l=3.9u w=8.1u
M6 N005 N004 neg neg NMOS l=3.9u w=2.1u
M7 N005 N004 N004 neg NMOS l=3.9u w=8.1u
M8 N004 Bias Vdd Vdd PMOS l=3.9u w=1.8u
M9 N003 N003 N005 neg NMOS l=3.9u w=2.1u
M10 Vdd Bias N003 Vdd PMOS l=3.9u w=8.1u
M11 Vdd Vdd N001 Vdd PMOS l=3.9u w=8.1u
M12 Vdd Vdd Cascode Vdd PMOS l=3.9u w=8.1u
M13 Cascode neg neg neg NMOS l=3.9u w=2.1u
M14 neg N004 Cascode neg NMOS l=3.9u w=2.1u
M15 Bias N004 neg neg NMOS l=8.1u w=.9u
M16 Cascode Cascode N002 Vdd PMOS l=3.9u w=8.1u
M17 N002 Bias Bias Vdd PMOS l=.9u w=8.1u
M18 N002 Bias Vdd Vdd PMOS l=3.9u w=8.1u
M19 N006 N004 neg neg NMOS l=3.9u w=2.1u
M20 N006 N004 N004 neg NMOS l=3.9u w=8.1u
M21 N004 Bias Vdd Vdd PMOS l=3.9u w=1.8u
M22 N003 N003 N006 neg NMOS l=3.9u w=2.1u
M23 Vdd Bias N003 Vdd PMOS l=3.9u w=8.1u
M24 Vdd Vdd N002 Vdd PMOS l=3.9u w=8.1u
M25 Vdd Vdd Cascode Vdd PMOS l=3.9u w=8.1u
M26 Cascode neg neg neg NMOS l=3.9u w=2.1u
.ends doublebiaslvs

.model NMOS NMOS
.model PMOS PMOS
.lib standard.mos
.backanno
.end